# Altium schematic sheet Sheet1.SchDoc (part 1 of 2)
size A1; SheetNumber: 1; SheetTotal: 1
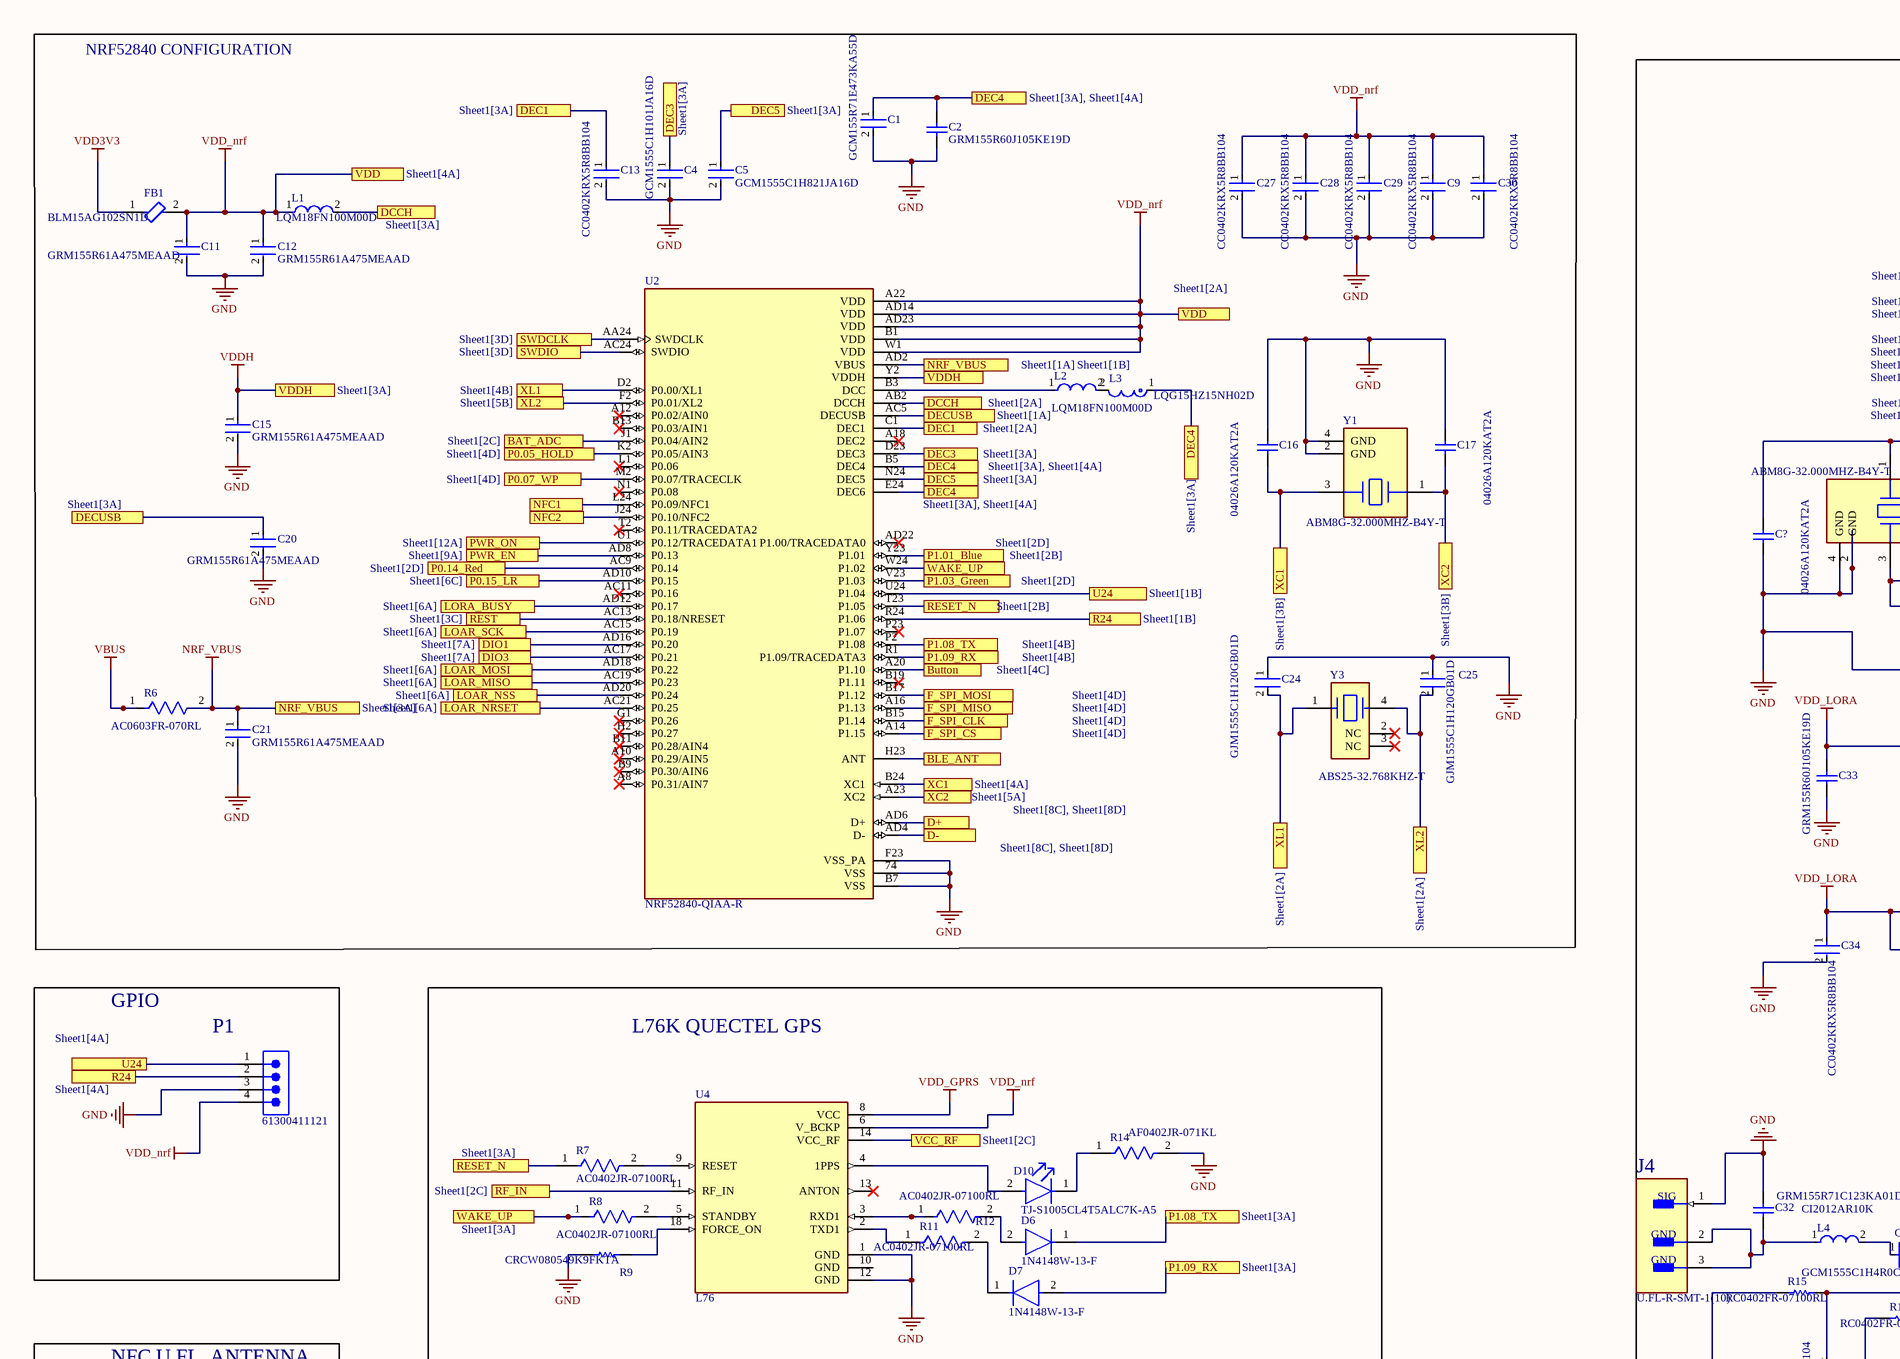
[diagram p0: Sheet1.SchDoc, top left]
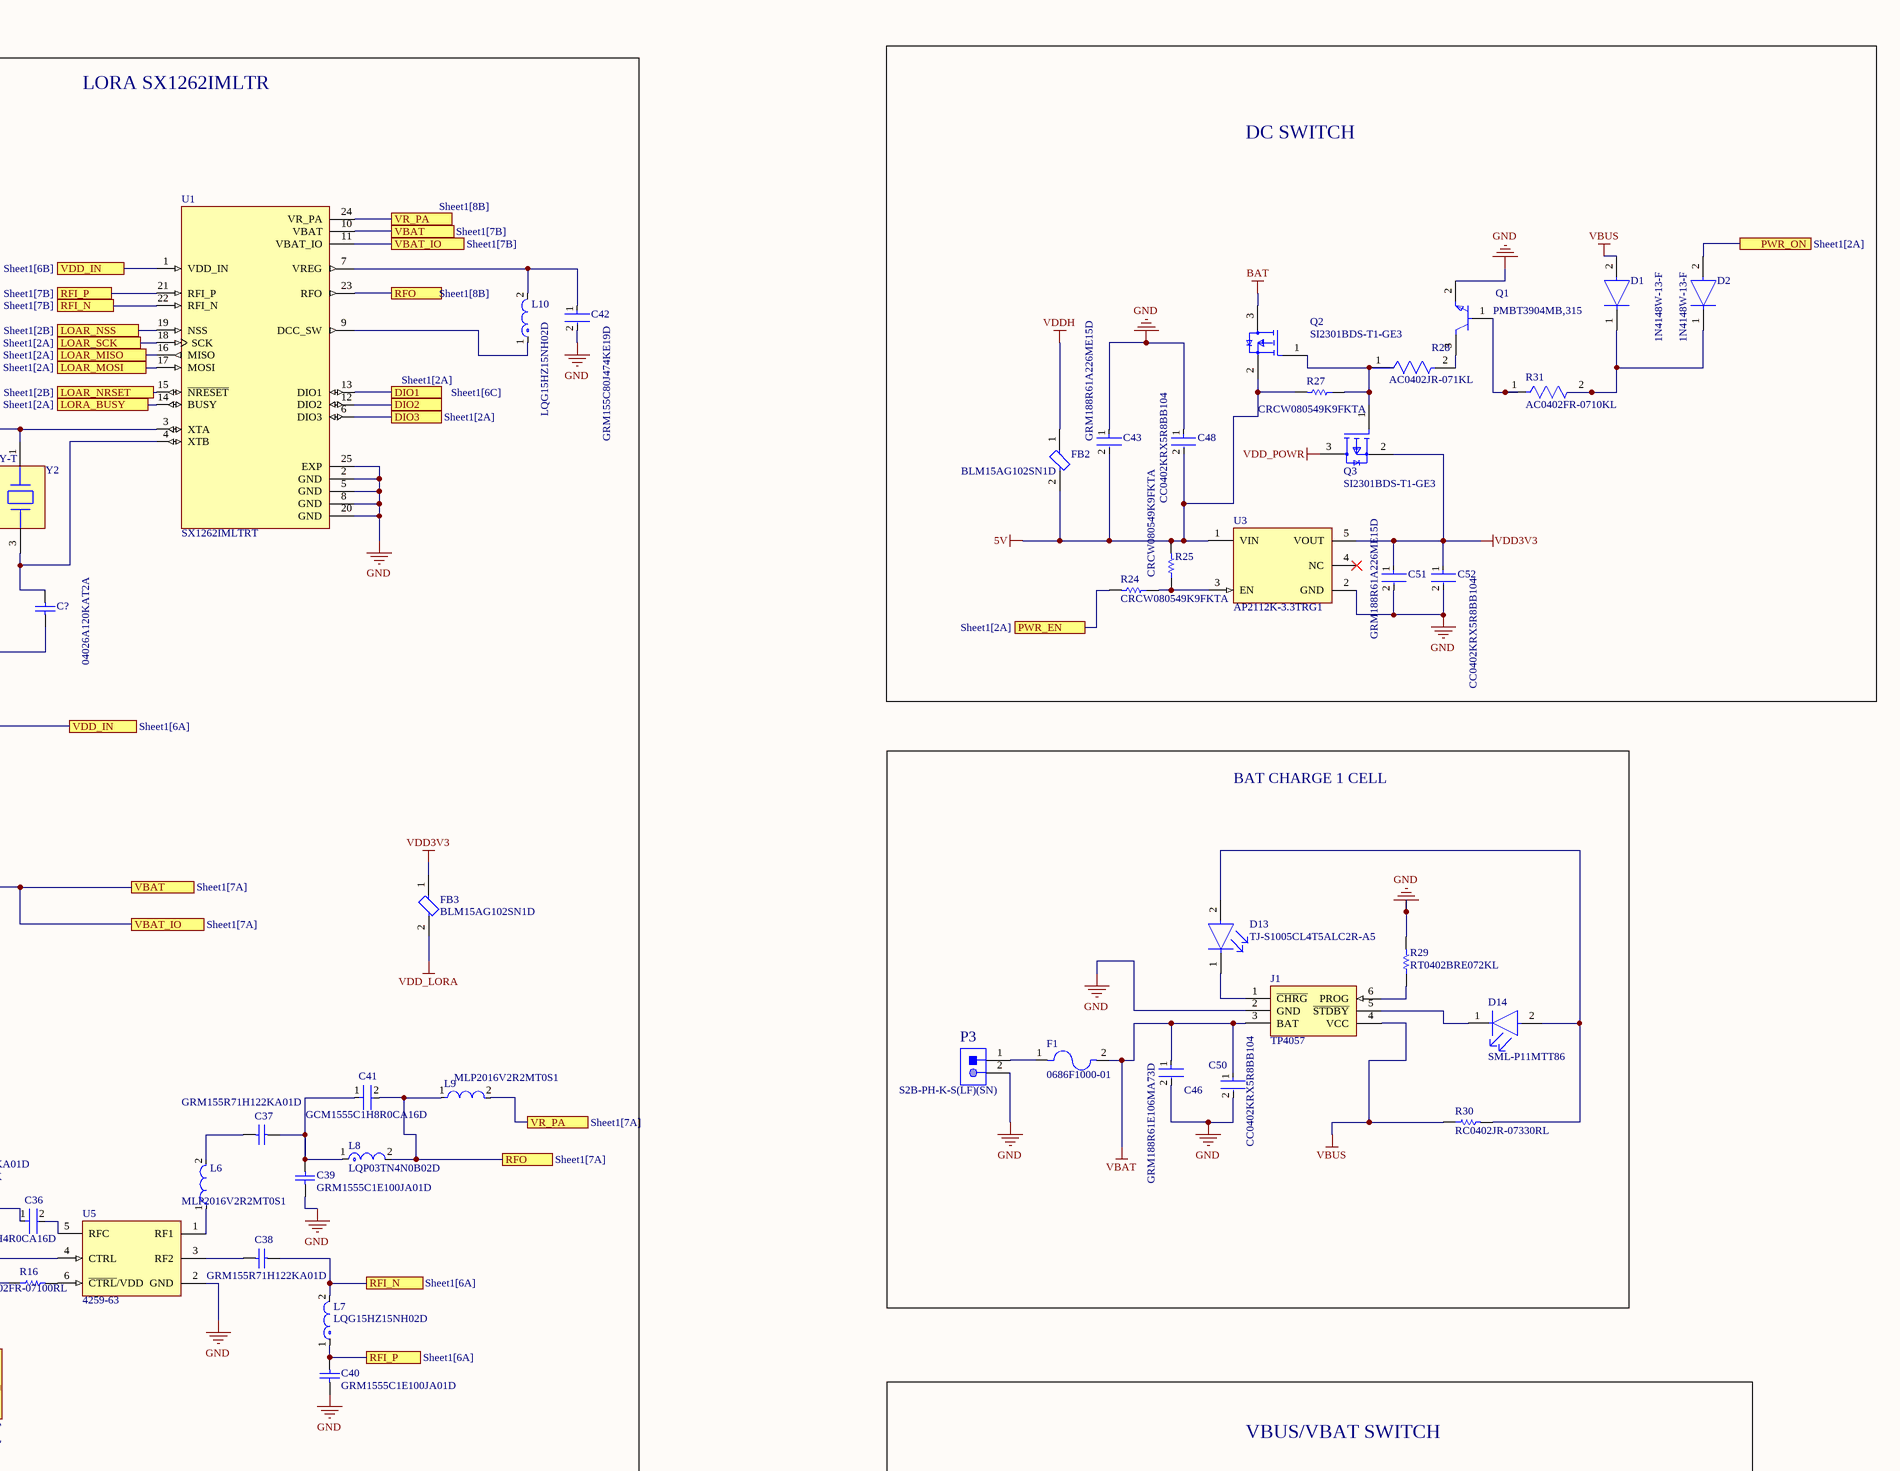
[diagram p1: Sheet1.SchDoc, top right]
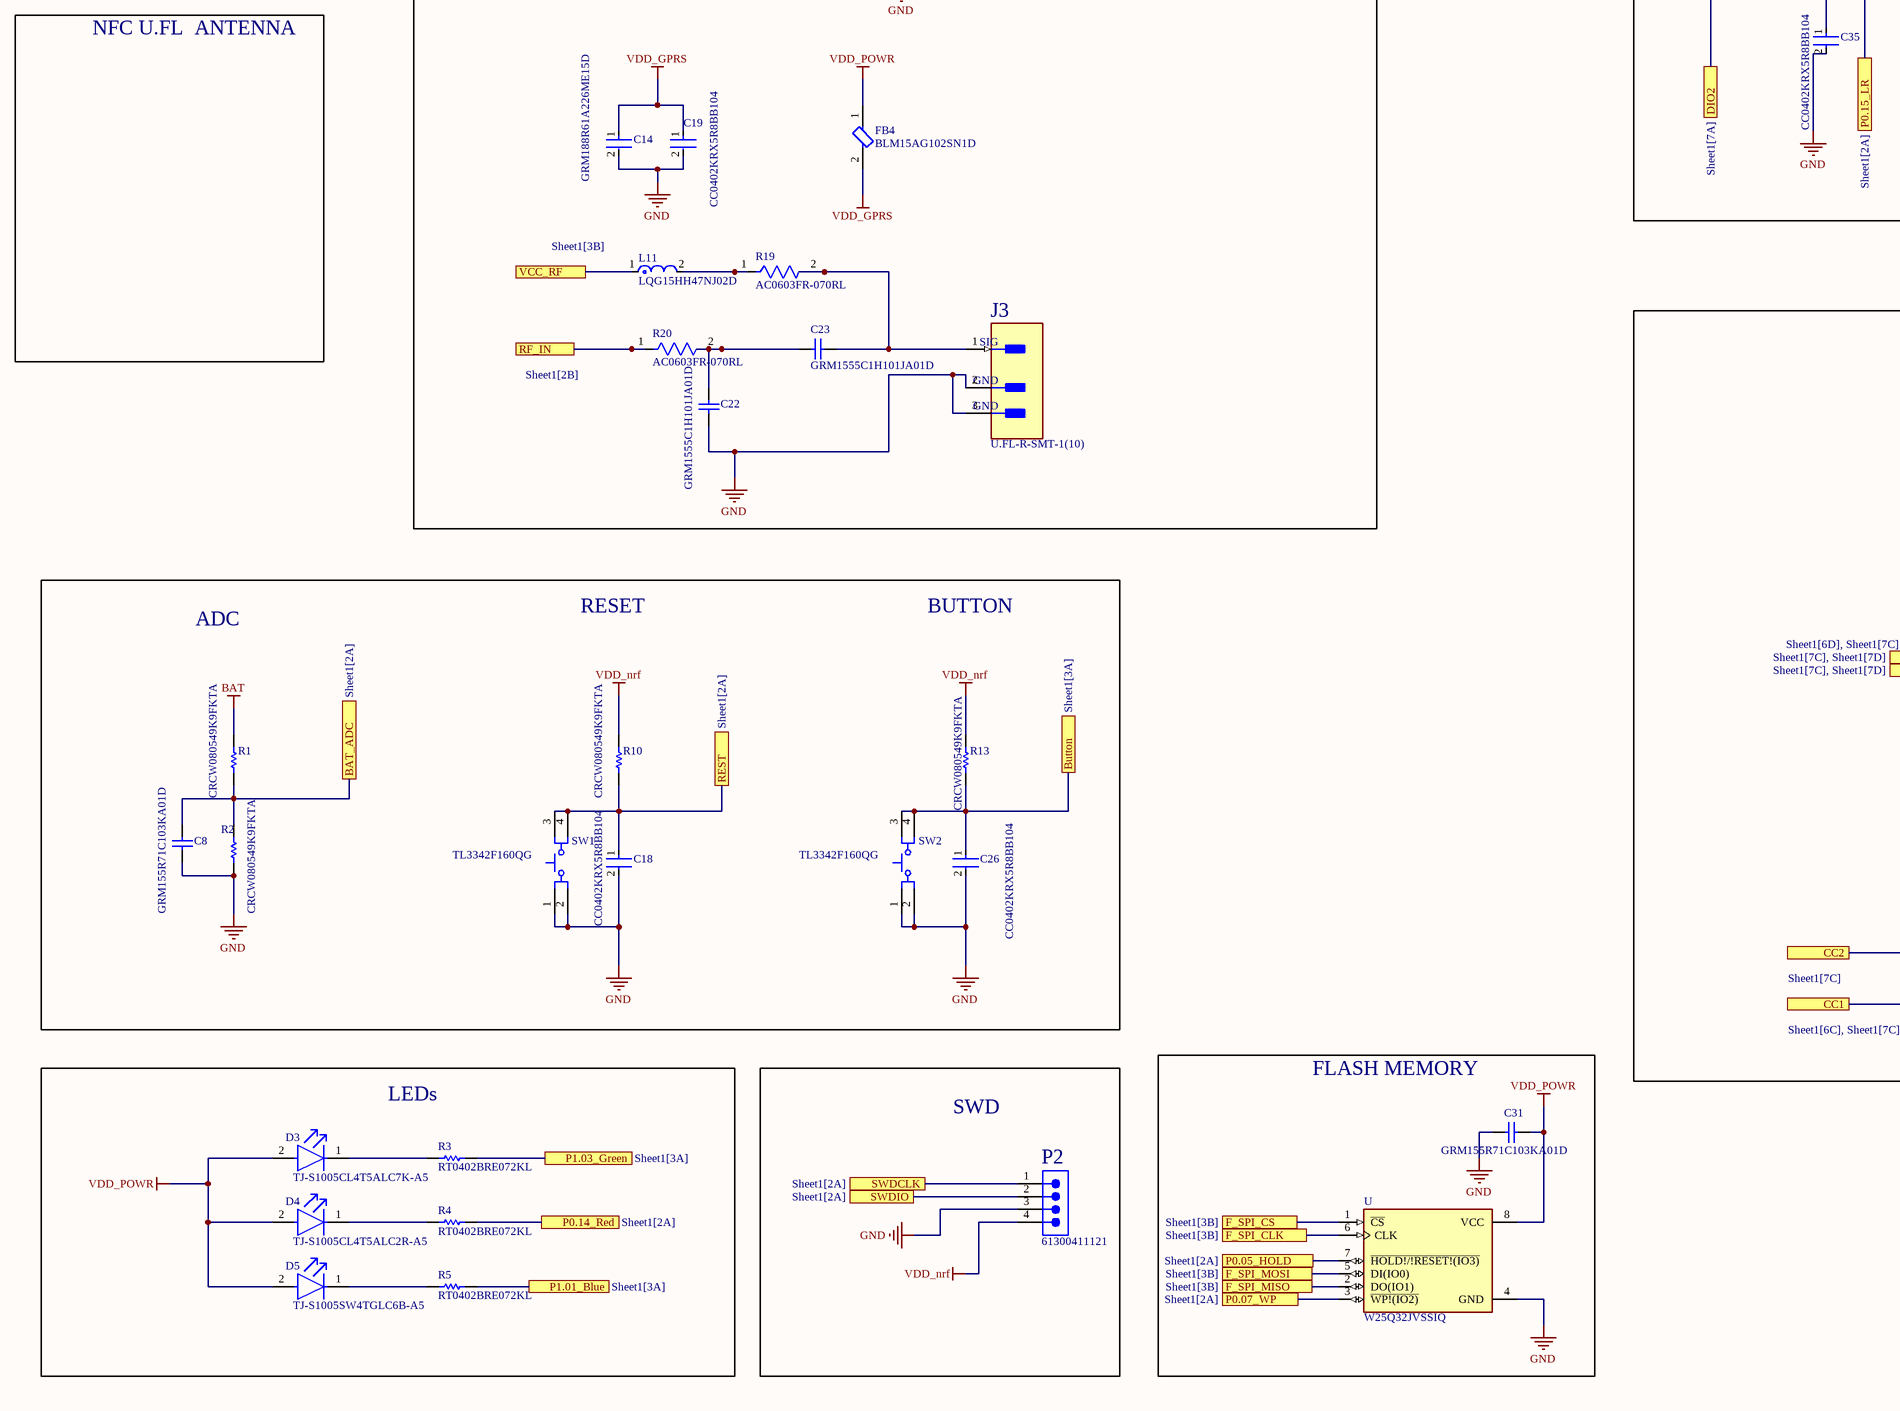
[diagram p2: Sheet1.SchDoc, bottom left]
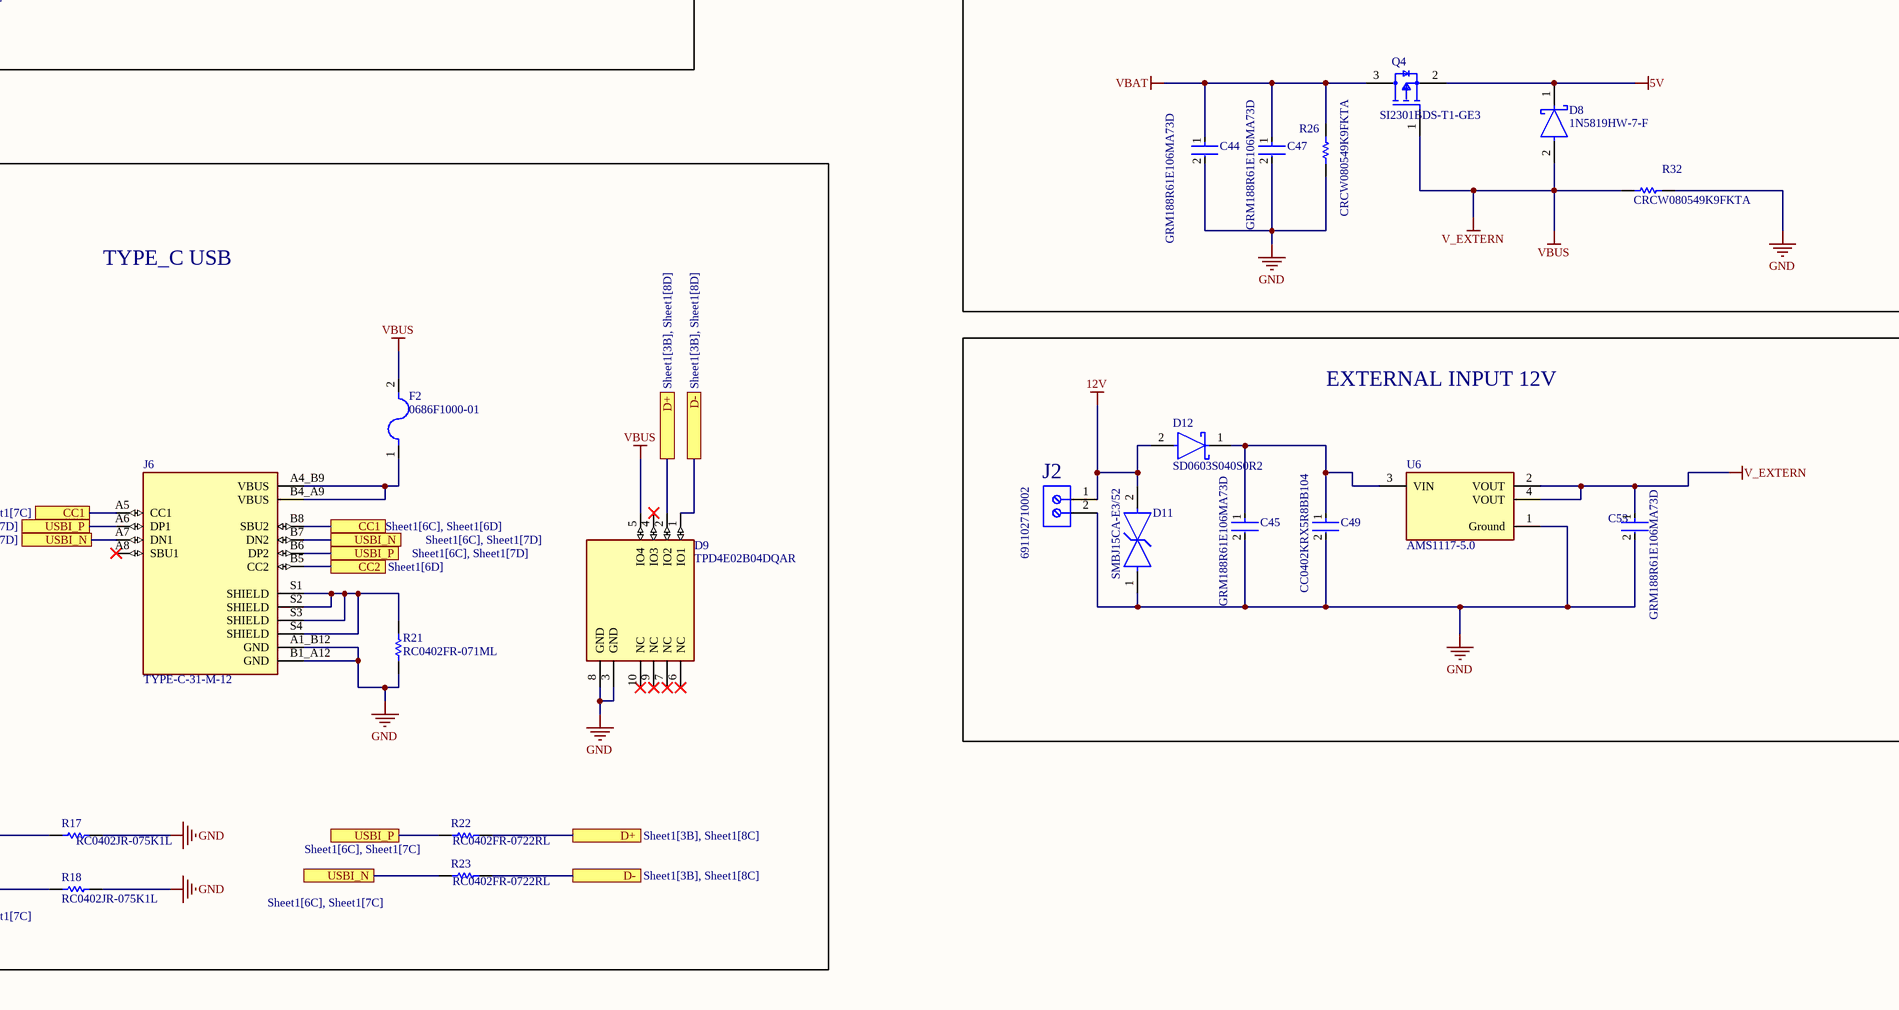
[diagram p3: Sheet1.SchDoc, bottom right]

## Parts
(Parts that share a designator on the sheet are numbered #1, #2 ... from top to bottom, then left to right.)
C1  GCM155R71E473KA55D  [FP-GCM155-0_05-IPC_B]
C2  GRM155R60J105KE19D  [CAPC1005X55X25NL5T10]
C4  GCM1555C1H101JA16D  [FP-GCM155-0_05-IPC_C]
C5  GCM1555C1H821JA16D  [FP-GCM155-0_05-IPC_A]
C8  GRM155R71C103KA01D  [CAPC1005X55X25LL05T10]
C9  CC0402KRX5R8BB104  [FP-CC0402-MFG]
C11  GRM155R61A475MEAAD  [FP-GRM155-0_15-MFG]
C12  GRM155R61A475MEAAD  [FP-GRM155-0_15-MFG]
C13  CC0402KRX5R8BB104  [FP-CC0402-MFG]
C14  GRM188R61A226ME15D  [FP-GRM188-0_2-IPC_C]
C15  GRM155R61A475MEAAD  [FP-GRM155-0_15-MFG]
C16  04026A120KAT2A  [CAPC1005X56X25NL10T15]
C17  04026A120KAT2A  [CAPC1005X56X25NL10T15]
C18  CC0402KRX5R8BB104  [FP-CC0402-MFG]
C19  CC0402KRX5R8BB104  [FP-CC0402-MFG]
C20  GRM155R61A475MEAAD  [FP-GRM155-0_15-MFG]
C21  GRM155R61A475MEAAD  [FP-GRM155-0_15-MFG]
C22  GRM1555C1H101JA01D  [CAPC1005X55X25ML05T10]
C23  GRM1555C1H101JA01D  [CAPC1005X55X25ML05T10]
C24  GJM1555C1H120GB01D  [FP-GJM155-0_05-IPC_A]
C25  GJM1555C1H120GB01D  [FP-GJM155-0_05-IPC_A]
C26  CC0402KRX5R8BB104  [FP-CC0402-MFG]
C27  CC0402KRX5R8BB104  [FP-CC0402-MFG]
C28  CC0402KRX5R8BB104  [FP-CC0402-MFG]
C29  CC0402KRX5R8BB104  [FP-CC0402-MFG]
C30  CC0402KRX5R8BB104  [FP-CC0402-MFG]
C31  GRM155R71C103KA01D  [CAPC1005X55X25LL05T10]
C32  GRM155R71C123KA01D  [CAPC1005X55X25ML05T10]
C33  GRM155R60J105KE19D  [CAPC1005X55X25NL5T10]
C34  CC0402KRX5R8BB104  [FP-CC0402-MFG]
C35  CC0402KRX5R8BB104  [FP-CC0402-MFG]
C36  GCM1555C1H4R0CA16D  [FP-GCM155-0_05-MFG]
C37  GRM155R71H122KA01D  [CAPC1005X55X25ML05T10]
C38  GRM155R71H122KA01D  [CAPC1005X55X25ML05T10]
C39  GRM1555C1E100JA01D  [CAPC1005X55X25ML05T10]
C40  GRM1555C1E100JA01D  [CAPC1005X55X25ML05T10]
C41  GCM1555C1H8R0CA16D  [FP-GCM155-0_05-IPC_B]
C42  GRM155C80J474KE19D  [FP-GRM155-0_05-IPC_C]
C43  GRM188R61A226ME15D  [FP-GRM188-0_2-IPC_C]
C44  GRM188R61E106MA73D  [FP-GRM188-0_2-MFG]
C45  GRM188R61E106MA73D  [FP-GRM188-0_2-MFG]
C46  GRM188R61E106MA73D  [FP-GRM188-0_2-MFG]
C47  GRM188R61E106MA73D  [FP-GRM188-0_2-MFG]
C48  CC0402KRX5R8BB104  [FP-CC0402-MFG]
C49  CC0402KRX5R8BB104  [FP-CC0402-MFG]
C50  CC0402KRX5R8BB104  [FP-CC0402-MFG]
C51  GRM188R61A226ME15D  [FP-GRM188-0_2-IPC_C]
C52  CC0402KRX5R8BB104  [FP-CC0402-MFG]
C53  GRM188R61E106MA73D  [FP-GRM188-0_2-MFG]
C?#1  04026A120KAT2A  [CAPC1005X56X25NL10T15]
C?#2  04026A120KAT2A  [CAPC1005X56X25NL10T15]
D1  1N4148W-13-F  [FP-SOD123-MFG]
D2  1N4148W-13-F  [FP-SOD123-MFG]
D3  TJ-S1005CL4T5ALC7K-A5  [FP-SML-P11MTT86-MFG]
D4  TJ-S1005CL4T5ALC2R-A5  [FP-SML-P11MTT86-MFG]
D5  TJ-S1005SW4TGLC6B-A5  [FP-SML-P11MTT86-MFG]
D6  1N4148W-13-F  [FP-SOD123-MFG]
D7  1N4148W-13-F  [FP-SOD123-MFG]
D8  1N5819HW-7-F  [FP-SOD123-IPC_A]
D9  TPD4E02B04DQAR  [FP-DQA0010A-MFG]
D10  TJ-S1005CL4T5ALC7K-A5  [FP-SML-P11MTT86-MFG]
D11  SMBJ15CA-E3/52  [FP-95401-CA-MFG]
D12  SD0603S040S0R2  [FP-SD0603-MFG]
D13  TJ-S1005CL4T5ALC2R-A5  [FP-SML-P11MTT86-MFG]
D14  SML-P11MTT86  [FP-SML-P11MTT86-MFG]
F1  0686F1000-01  [FUSC1608X60N]
F2  0686F1000-01  [FUSC1608X60N]
FB1  BLM15AG102SN1D  [FP-BLM15-0_05-IPC_B]
FB2  BLM15AG102SN1D  [FP-BLM15-0_05-IPC_B]
FB3  BLM15AG102SN1D  [FP-BLM15-0_05-IPC_B]
FB4  BLM15AG102SN1D  [FP-BLM15-0_05-IPC_B]
J1  TP4057  [SOT23-6]
J2  691102710002  [691102710002]
J3  U.FL-R-SMT-1(10)  [FP-U_FL-R-SMT-1_10-MFG]
J4  U.FL-R-SMT-1(10)  [FP-U_FL-R-SMT-1_10-MFG]
J6  TYPE-C-31-M-12  [HRO_TYPE-C-31-M-12]
L1  LQM18FN100M00D  [FP-LQM18FN_00-IPC_C]
L2  LQM18FN100M00D  [FP-LQM18FN_00-IPC_C]
L3  LQG15HZ15NH02D  [FP-LQG15HH_02-IPC_A]
L4  CI2012AR10K  [FP-LB2012-1_25-0_2-IPC_C]
L6  MLP2016V2R2MT0S1  [FP-MLP2016M-IPC_A]
L7  LQG15HZ15NH02D  [FP-LQG15HH_02-IPC_A]
L8  LQP03TN4N0B02D  [FP-LQP03TG_02-IPC_C]
L9  MLP2016V2R2MT0S1  [FP-MLP2016M-IPC_A]
L10  LQG15HZ15NH02D  [FP-LQG15HH_02-IPC_A]
L11  LQG15HH47NJ02D  [FP-LQG15HH_02-IPC_C]
P1  61300411121  [61300411121]
P2  61300411121  [61300411121]
P3  S2B-PH-K-S(LF)(SN)  [JST-S2B-PH-K-S_V]
Q1  PMBT3904MB,315  [FP-SOT883B-MFG]
Q2  SI2301BDS-T1-GE3  [FP-S-03946-MFG]
Q3  SI2301BDS-T1-GE3  [FP-S-03946-MFG]
Q4  SI2301BDS-T1-GE3  [FP-S-03946-MFG]
R1  CRCW080549K9FKTA  [RESC2013X50X30LL20T20]
R2  CRCW080549K9FKTA  [RESC2013X50X30LL20T20]
R3  RT0402BRE072KL  [RESC1005X40X25NL05T10]
R4  RT0402BRE072KL  [RESC1005X40X25NL05T10]
R5  RT0402BRE072KL  [RESC1005X40X25NL05T10]
R6  AC0603FR-070RL  [FP-AC0603-0_55-MFG]
R7  AC0402JR-07100RL  [FP-AC0402-IPC_A]
R8  AC0402JR-07100RL  [FP-AC0402-IPC_A]
R9  CRCW080549K9FKTA  [RESC2013X50X30LL20T20]
R10  CRCW080549K9FKTA  [RESC2013X50X30LL20T20]
R11  AC0402JR-07100RL  [FP-AC0402-IPC_A]
R12  AC0402JR-07100RL  [FP-AC0402-IPC_A]
R13  CRCW080549K9FKTA  [RESC2013X50X30LL20T20]
R14  AF0402JR-071KL  [FP-AF0402-MFG]
R15  RC0402FR-07100RL  [RESC1005X40X25ML05T10]
R16  RC0402FR-07100RL  [RESC1005X40X25ML05T10]
R17  RC0402JR-075K1L  [RESC1005X40X25ML05T10]
R18  RC0402JR-075K1L  [RESC1005X40X25ML05T10]
R19  AC0603FR-070RL  [FP-AC0603-0_55-MFG]
R20  AC0603FR-070RL  [FP-AC0603-0_55-MFG]
R21  RC0402FR-071ML  [RESC1005X40X25NL05T10]
R22  RC0402FR-0722RL  [RESC1005X40X25LL05T10]
R23  RC0402FR-0722RL  [RESC1005X40X25LL05T10]
R24  CRCW080549K9FKTA  [RESC2013X50X30LL20T20]
R25  CRCW080549K9FKTA  [RESC2013X50X30LL20T20]
R26  CRCW080549K9FKTA  [RESC2013X50X30LL20T20]
R27  CRCW080549K9FKTA  [RESC2013X50X30LL20T20]
R28  AC0402JR-071KL  [FP-AC0402-IPC_C]
R29  RT0402BRE072KL  [RESC1005X40X25NL05T10]
R30  RC0402JR-07330RL  [RESC1005X40X25NL05T10]
R31  AC0402FR-0710KL  [FP-AC0402-MFG]
R32  CRCW080549K9FKTA  [RESC2013X50X30LL20T20]
SW1  TL3342F160QG  [ESWI-TL3342F160QG_V]
SW2  TL3342F160QG  [ESWI-TL3342F160QG_V]
U  W25Q32JVSSIQ  [SOIC127P790X216-8N]
U1  SX1262IMLTRT  [QFN50P400X400X100-25N]
U2  NRF52840-QIAA-R  [XCVR_NRF52840-QIAA-R]
U3  AP2112K-3.3TRG1  [FP-SOT25-IPC_A]
U4  L76  [XCVR_L76]
U5  4259-63  [PERE-SC-70-6_M]
U6  AMS1117-5.0  [FP-AMS1117-IPC_C]
Y1  ABM8G-32.000MHZ-B4Y-T  [FP-ABM8G-MFG]
Y2  ABM8G-32.000MHZ-B4Y-T  [FP-ABM8G-MFG]
Y3  ABS25-32.768KHZ-T  [FP-ABS25-MFG]

## Blocks framed on the sheet
NRF52840 CONFIGURATION: C1 C2 C4 C5 C9 C11-C13 C15-C17 C20 C21 C24 C25 C27-C30 FB1 L1-L3 R6 U2 Y1 Y3
DC SWITCH: C43 C48 C51 C52 D1 D2 FB2 Q1-Q3 R24 R25 R27 R28 R31 U3
BAT CHARGE 1 CELL: C46 C50 D13 D14 F1 J1 P3 R29 R30
GPIO: P1
L76K QUECTEL GPS: C14 C19 C22 C23 D6 D7 D10 FB4 J3 L11 R7-R9 R11 R12 R14 R19 R20 U4
VBUS/VBAT SWITCH: C44 C47 D8 Q4 R26 R32
TYPE_C USB: D9 F2 J6 R17 R18 R21-R23
EXTERNAL INPUT 12V: C45 C49 C53 D11 D12 J2 U6
FLASH MEMORY: C31 U
LEDs: D3-D5 R3-R5
SWD: P2

## Ports
BAT_ADC (see Sheet1[2A]), BAT_ADC (see Sheet1[2C]), BLE_ANT, Button (see Sheet1[3A]), Button (see Sheet1[4C]), CC1 (see Sheet1[6C], Sheet1[6D]), CC1 (see Sheet1[6C], Sheet1[7C]), CC1 (see Sheet1[6D], Sheet1[7C]), CC2 (see Sheet1[6D]), CC2 (see Sheet1[7C]), D+ (see Sheet1[3B], Sheet1[8C]), D+ (see Sheet1[3B], Sheet1[8D]), D+ (see Sheet1[8C], Sheet1[8D]), D- (see Sheet1[3B], Sheet1[8C]), D- (see Sheet1[3B], Sheet1[8D]), D- (see Sheet1[8C], Sheet1[8D]), DCCH (see Sheet1[2A]), DCCH (see Sheet1[3A]), DEC1 (see Sheet1[2A]), DEC1 (see Sheet1[3A]), DEC3 (see Sheet1[3A]), DEC4 (see Sheet1[3A]), DEC4 (see Sheet1[3A], Sheet1[4A]), DEC5 (see Sheet1[3A]), DECUSB (see Sheet1[1A]), DECUSB (see Sheet1[3A]), DIO1 (see Sheet1[2A]), DIO1 (see Sheet1[7A]), DIO2 (see Sheet1[6C]), DIO2 (see Sheet1[7A]), DIO3 (see Sheet1[2A]), DIO3 (see Sheet1[7A]), F_SPI_CLK (see Sheet1[3B]), F_SPI_CLK (see Sheet1[4D]), F_SPI_CS (see Sheet1[3B]), F_SPI_CS (see Sheet1[4D]), F_SPI_MISO (see Sheet1[3B]), F_SPI_MISO (see Sheet1[4D]), F_SPI_MOSI (see Sheet1[3B]), F_SPI_MOSI (see Sheet1[4D]), LOAR_MISO (see Sheet1[2A]), LOAR_MISO (see Sheet1[6A]), LOAR_MOSI (see Sheet1[2A]), LOAR_MOSI (see Sheet1[6A]), LOAR_NRSET (see Sheet1[2B]), LOAR_NRSET (see Sheet1[6A]), LOAR_NSS (see Sheet1[2B]), LOAR_NSS (see Sheet1[6A]), LOAR_SCK (see Sheet1[2A]), LOAR_SCK (see Sheet1[6A]), LORA_BUSY (see Sheet1[2A]), LORA_BUSY (see Sheet1[6A]), NFC1, NFC2, NRF_VBUS (see Sheet1[1B]), NRF_VBUS (see Sheet1[3A]), P0.05_HOLD (see Sheet1[2A]), P0.05_HOLD (see Sheet1[4D]), P0.07_WP (see Sheet1[2A]), P0.07_WP (see Sheet1[4D]), P0.14_Red (see Sheet1[2A]), P0.14_Red (see Sheet1[2D]), P0.15_LR (see Sheet1[2A]), P0.15_LR (see Sheet1[6C]), P1.01_Blue (see Sheet1[2D]), P1.01_Blue (see Sheet1[3A]), P1.03_Green (see Sheet1[2D]), P1.03_Green (see Sheet1[3A]), P1.08_TX (see Sheet1[3A]), P1.08_TX (see Sheet1[4B]), P1.09_RX (see Sheet1[3A]), P1.09_RX (see Sheet1[4B]), PWR_EN (see Sheet1[2A]), PWR_EN (see Sheet1[9A]), PWR_ON (see Sheet1[2A]), PWR_ON (see Sheet1[12A]), R24 (see Sheet1[1B]), R24 (see Sheet1[4A]), RESET_N (see Sheet1[2B]), RESET_N (see Sheet1[3A]), REST (see Sheet1[2A]), REST (see Sheet1[3C]), RF_IN (see Sheet1[2B]), RF_IN (see Sheet1[2C]), RFI_N (see Sheet1[6A]), RFI_N (see Sheet1[7B]), RFI_P (see Sheet1[6A]), RFI_P (see Sheet1[7B]), RFO (see Sheet1[7A]), RFO (see Sheet1[8B]), SWDCLK (see Sheet1[2A]), SWDCLK (see Sheet1[3D]), SWDIO (see Sheet1[2A]), SWDIO (see Sheet1[3D]), U24 (see Sheet1[1B]), U24 (see Sheet1[4A]), USBI_N (see Sheet1[6C], Sheet1[7C]), USBI_N (see Sheet1[6C], Sheet1[7D]), USBI_N (see Sheet1[7C], Sheet1[7D]), USBI_P (see Sheet1[6C], Sheet1[7C]), USBI_P (see Sheet1[6C], Sheet1[7D]), USBI_P (see Sheet1[7C], Sheet1[7D]), VBAT (see Sheet1[7A]), VBAT (see Sheet1[7B]), VBAT_IO (see Sheet1[7A]), VBAT_IO (see Sheet1[7B]), VCC_RF (see Sheet1[2C]), VCC_RF (see Sheet1[3B]), VDD (see Sheet1[2A]), VDD (see Sheet1[4A]), VDD_IN (see Sheet1[6A]), VDD_IN (see Sheet1[6B]), VDDH (see Sheet1[1A]), VDDH (see Sheet1[3A]), VR_PA (see Sheet1[7A]), VR_PA (see Sheet1[8B]), WAKE_UP (see Sheet1[2B]), WAKE_UP (see Sheet1[3A]), XC1 (see Sheet1[3B]), XC1 (see Sheet1[4A]), XC2 (see Sheet1[3B]), XC2 (see Sheet1[5A]), XL1 (see Sheet1[2A]), XL1 (see Sheet1[4B]), XL2 (see Sheet1[2A]), XL2 (see Sheet1[5B])

## Nets
5V: C43.2 C48.2 D8.1(C) FB2.2 Q2.2(S) Q4.2(S) R25.2 R27.2 U3.1(VIN)
12V: D11.2 D12.2(A) J2.1
BAT: Q2.3(D) R1.2
GND: C1.2 C2.1 C4.2 C5.2 C8.1 C9.2 C11.2 C12.2 C13.2 C14.2 C15.2 C16.2 C17.2 C18.2 C19.2 C20.2 C21.2 C22.1 C24.1 C25.1 C26.2 C27.2 C28.2 C29.2 C30.2 C31.1 C32.2 C33.1 C34.2 C35.2 C39.2 C40.1 C42.2 C43.1 C44.2 C45.2 C46.2 C47.2 C48.1 C49.2 C50.2 C51.2 C52.2 C53.2 C?#1.1 C?#2.1 D9.3(GND) D9.8(GND) D11.1 J1.2(GND) J2.2 J3.2(GND) J3.3(GND) J4.1(SIG) J6.A1_B12(GND) J6.B1_A12(GND) P1.3 P2.3 P3.2 Q1.2(E) R2.1 R9.1 R14.2 R17.2 R18.2 R21.1 R26.1 R29.2 R32.2 SW1.1 SW1.2 SW2.1 SW2.2 U.4(GND) U1.2(GND) U1.5(GND) U1.8(GND) U1.20(GND) U1.25(EXP) U2.74(VSS) U2.B7(VSS) U2.F23(VSS_PA) U3.2(GND) U4.1(GND) U4.12(GND) U5.2(GND) U6.1(Ground) Y1.2(GND) Y1.4(GND) Y2.2(GND) Y2.4(GND)
NRF_VBUS: C21.1 R6.2 U2.AD2(VBUS) ; port NRF_VBUS
V_EXTERN: C53.1 D1.2(A) D8.2(A) D9.5(IO4) F2.2 J1.4(VCC) Q4.1(G) R6.1 R30.1 R32.1 U6.2(VOUT) U6.4(VOUT)  [also labelled VBUS]
VBAT: C44.1 C46.1 C47.1 C50.1 F1.2 J1.3(BAT) Q4.3(D) R26.2
VDD3V3: C51.1 C52.1 FB1.1 FB3.1 Q3.2(S) U3.5(VOUT)
VDD_GPRS: C14.1 C19.1 FB4.2 U4.8(VCC)
VDD_LORA: C33.2 C34.1 FB3.2 U1.1(VDD_IN) U1.10(VBAT) U1.11(VBAT_IO) ; port VDD_IN, port VBAT, port VBAT_IO
VDD_nrf: C9.1 C11.1 C12.1 C27.1 C28.1 C29.1 C30.1 FB1.2 L1.1 P1.4 P2.4 R10.2 R13.2 U2.A22(VDD) U2.AD14(VDD) U2.AD23(VDD) U2.B1(VDD) U2.W1(VDD) U4.6(V_BCKP) ; port VDD
VDD_POWR: C31.2 D3.2(A) D4.2(A) D5.2(A) FB4.1 Q3.3(D) U.8(VCC)
VDDH: C15.1 FB2.1 U2.Y2(VDDH) ; port VDDH
BAT_ADC: C8.2 R1.1 R2.2 U2.J1(P0.04/AIN2) ; port BAT_ADC
BLE_ANT: U2.H23(ANT) ; port BLE_ANT
Button: C26.1 R13.1 SW2.3 SW2.4 U2.A20(P1.10) ; port Button
CC1: J6.A5(CC1) J6.B8(SBU2) R18.1 ; port CC1
CC2: J6.B5(CC2) R17.1 ; port CC2
D+: D9.2(IO2) R22.2 U2.AD6(D+) ; port D+
D-: D9.1(IO1) R23.2 U2.AD4(D-) ; port D-
DCCH: L1.2 U2.AB2(DCCH) ; port DCCH
DEC1: C13.1 U2.C1(DEC1) ; port DEC1
DEC3: C4.1 U2.D23(DEC3) ; port DEC3
DEC4: C1.1 C2.2 L3.1 U2.B5(DEC4) U2.E24(DEC6) ; port DEC4
DEC5: C5.1 U2.N24(DEC5) ; port DEC5
DECUSB: C20.1 U2.AC5(DECUSB) ; port DECUSB
DIO1: U1.13(DIO1) U2.AD16(P0.20) ; port DIO1
DIO2: R15.1 U1.12(DIO2) ; port DIO2
DIO3: U1.6(DIO3) U2.AC17(P0.21) ; port DIO3
F_SPI_CLK: U.6(CLK) U2.B15(P1.14) ; port F_SPI_CLK
F_SPI_CS: U.1(~{CS}) U2.A14(P1.15) ; port F_SPI_CS
F_SPI_MISO: U.2(DO(IO1)) U2.A16(P1.13) ; port F_SPI_MISO
F_SPI_MOSI: U.5(DI(IO0)) U2.B17(P1.12) ; port F_SPI_MOSI
LOAR_MISO: U1.16(MISO) U2.AC19(P0.23) ; port LOAR_MISO
LOAR_MOSI: U1.17(MOSI) U2.AD18(P0.22) ; port LOAR_MOSI
LOAR_NRSET: U1.15(~{NRESET}) U2.AC21(P0.25) ; port LOAR_NRSET
LOAR_NSS: U1.19(NSS) U2.AD20(P0.24) ; port LOAR_NSS
LOAR_SCK: U1.18(SCK) U2.AC15(P0.19) ; port LOAR_SCK
LORA_BUSY: U1.14(BUSY) U2.AD12(P0.17) ; port LORA_BUSY
NFC1: U2.L24(P0.09/NFC1) ; port NFC1
NFC2: U2.J24(P0.10/NFC2) ; port NFC2
P0.05_HOLD: U.7(~{HOLD!/!RESET!(IO3)}) U2.K2(P0.05/AIN3) ; port P0.05_HOLD
P0.07_WP: U.3(~{WP!(IO2)}) U2.M2(P0.07/TRACECLK) ; port P0.07_WP
P0.14_Red: R4.1 U2.AC9(P0.14) ; port P0.14_Red
P0.15_LR: R16.1 U2.AD10(P0.15) ; port P0.15_LR
P1.01_Blue: R5.1 U2.Y23(P1.01) ; port P1.01_Blue
P1.03_Green: R3.1 U2.V23(P1.03) ; port P1.03_Green
P1.08_TX: D6.1(C) U2.P2(P1.08) ; port P1.08_TX
P1.09_RX: D7.2(A) U2.R1(P1.09/TRACEDATA3) ; port P1.09_RX
PWR_EN: R24.2 U2.AD8(P0.13) ; port PWR_EN
PWR_ON: D2.2(A) U2.U1(P0.12/TRACEDATA1) ; port PWR_ON
R24: P1.2 U2.R24(P1.06) ; port R24
RESET_N: R7.1 U2.T23(P1.05) ; port RESET_N
REST: C18.1 R10.1 SW1.3 SW1.4 U2.AC13(P0.18/NRESET) ; port REST
RF_IN: R20.1 U4.11(RF_IN) ; port RF_IN
RFI_N: C38.2 L7.2 U1.22(RFI_N) ; port RFI_N
RFI_P: C40.2 L7.1 U1.21(RFI_P) ; port RFI_P
RFO: C41.2 L8.2 L9.1 U1.23(RFO) ; port RFO
SWDCLK: P2.1 U2.AA24(SWDCLK) ; port SWDCLK
SWDIO: P2.2 U2.AC24(SWDIO) ; port SWDIO
U24: P1.1 U2.U24(P1.04) ; port U24
USBI_N: J6.A7(DN1) J6.B7(DN2) R23.1 ; port USBI_N
USBI_P: J6.A6(DP1) J6.B6(DP2) R22.1 ; port USBI_P
VCC_RF: L11.1 U4.14(VCC_RF) ; port VCC_RF
VR_PA: L9.2 U1.24(VR_PA) ; port VR_PA
WAKE_UP: R8.1 U2.W24(P1.02) ; port WAKE_UP
XC1: C16.1 U2.B24(XC1) Y1.3 ; port XC1
XC2: C17.1 U2.A23(XC2) Y1.1 ; port XC2
XL1: C24.2 U2.D2(P0.00/XL1) Y3.1 ; port XL1
XL2: C25.2 U2.F2(P0.01/XL2) Y3.4 ; port XL2
NetC22_2: C22.2 C23.1 R20.2
NetC23_2: C23.2 J3.1(SIG) R19.2
NetC32_1: C32.1 J4.2(GND) J4.3(GND) L4.1
NetC35_1: C35.1 R15.2 U5.4(CTRL)
NetC36_1: C36.1 L4.2
NetC36_2: C36.2 U5.5(RFC)
NetC37_1: C37.1 L6.2
NetC37_2: C37.2 C39.1 C41.1 L8.1
NetC38_1: C38.1 U5.3(RF2)
NetC42_1: C42.1 L10.2 U1.7(VREG)
NetC45_1: C45.1 C49.1 D12.1(C) U6.3(VIN)
NetC?#1_2: C?#1.2 U1.3(XTA) Y2.1
NetC?#2_2: C?#2.2 U1.4(XTB) Y2.3
NetD1_1: D1.1(C) D2.1(C) R31.2
NetD3_1: D3.1(C) R3.2
NetD4_1: D4.1(C) R4.2
NetD5_1: D5.1(C) R5.2
NetD6_2: D6.2(A) R12.2
NetD7_1: D7.1(C) R11.2
NetD10_1: D10.1(C) R14.1
NetD10_2: D10.2(A) U4.4(1PPS)
NetD13_1: D13.1(C) J1.1(~{CHRG})
NetD13_2: D13.2(A) D14.2(A) R30.2
NetD14_1: D14.1(C) J1.5(~{STDBY})
NetF1_1: F1.1 P3.1
NetF2_1: F2.1 J6.A4_B9(VBUS) J6.B4_A9(VBUS)
NetJ1_6: J1.6(PROG) R29.1
NetJ6_S1: J6.S1(SHIELD) J6.S2(SHIELD) J6.S3(SHIELD) J6.S4(SHIELD) R21.2
NetL2_1: L2.1 U2.B3(DCC)
NetL2_2: L2.2 L3.2
NetL6_1: L6.1 U5.1(RF1)
NetL10_1: L10.1 U1.9(DCC_SW)
NetL11_2: L11.2 R19.1
NetQ1_1: Q1.1(B) R31.1
NetQ1_3: Q1.3(C) R28.2
NetQ2_1: Q2.1(G) Q3.1(G) R27.1 R28.1
NetR7_2: R7.2 U4.9(RESET)
NetR8_2: R8.2 U4.5(STANDBY)
NetR9_2: R9.2 U4.18(FORCE_ON)
NetR11_1: R11.1 U4.2(TXD1)
NetR12_1: R12.1 U4.3(RXD1)
NetR16_2: R16.2 U5.6(~{CTRL}/VDD)
NetR24_1: R24.1 R25.1 U3.3(EN)

Not connected (* = marked no-connect by the designer): D9 4(IO3)* 6(NC)* 7(NC)* 9(NC)* 10(NC)*; J6 A8(SBU1)*; U2 A8(P0.31/AIN7)* A10(P0.29/AIN5)* A12(P0.02/AIN0)* A18(DEC2)* AC11(P0.16)* AD22(P1.00/TRACEDATA0)* B9(P0.30/AIN6)* B11(P0.28/AIN4)* B13(P0.03/AIN1)* B19(P1.11)* G1(P0.26)* H2(P0.27)* L1(P0.06)* N1(P0.08)* P23(P1.07)* T2(P0.11/TRACEDATA2)*; U3 4(NC)*; U4 10(GND) 13(ANTON)*; Y3 2(NC)* 3(NC)*

## Notes on the sheet
- LORA SX1262IMLTR
- NFC U.FL  ANTENNA
- ADC
- RESET
- BUTTON